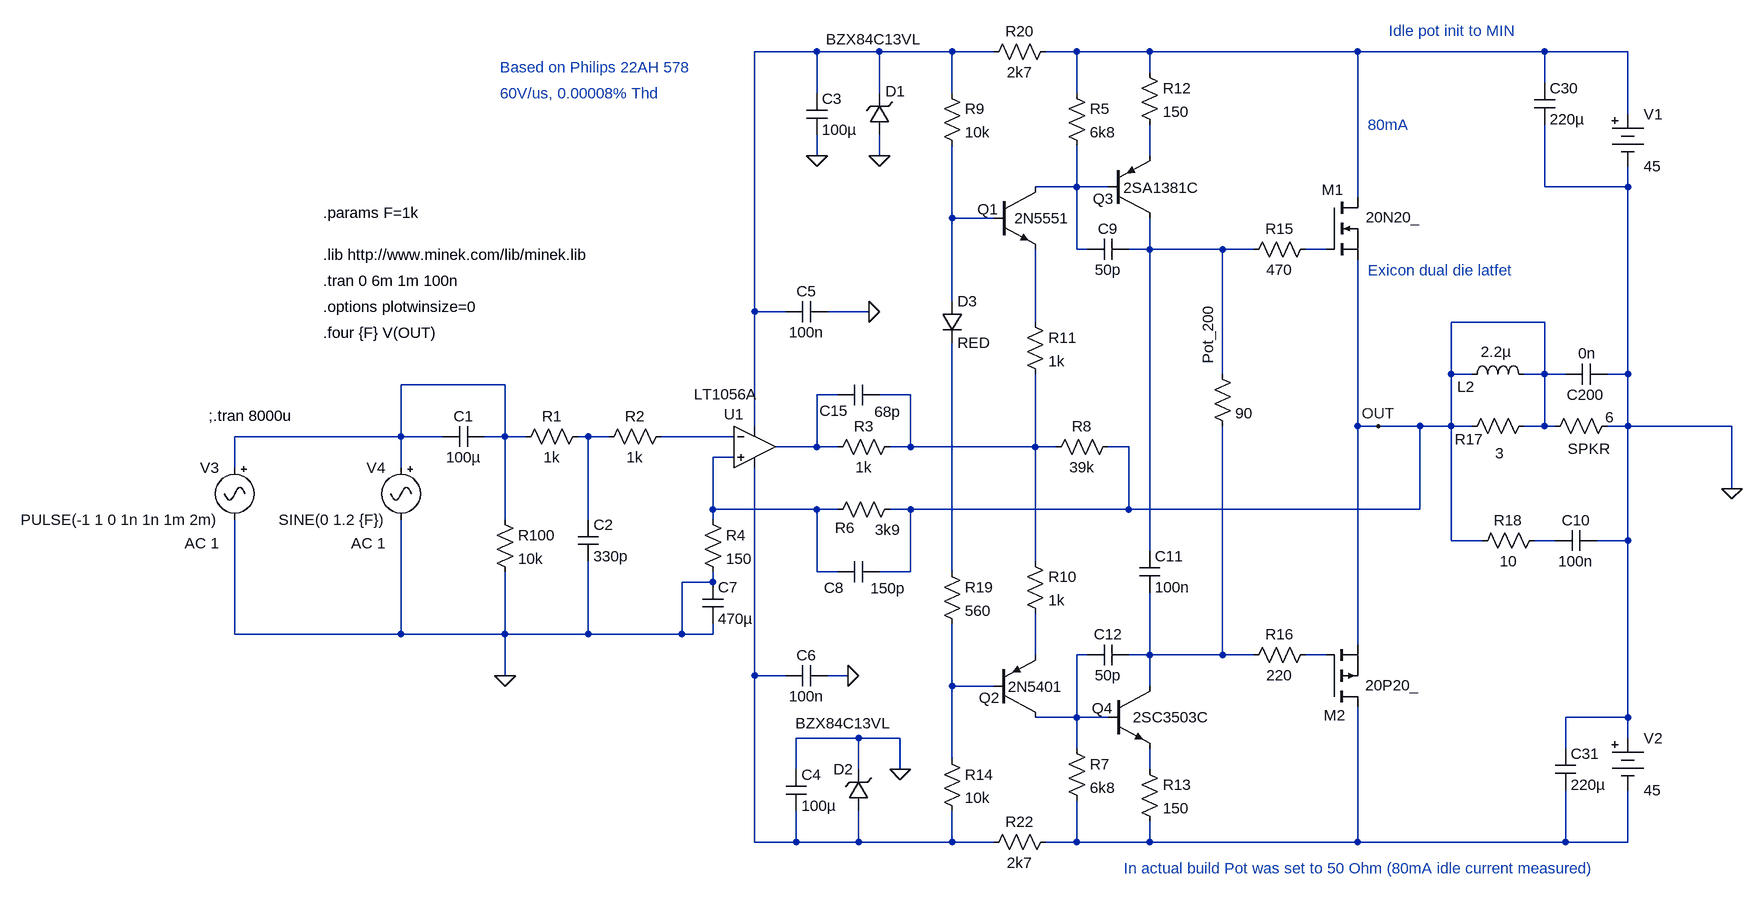
[diagram p0: schematic aa.asc]
aa.asc, the LTspice schematic file:
Version 4
SHEET 1 1932 832
WIRE -1568 -880 -1664 -880
WIRE -1472 -880 -1568 -880
WIRE -1360 -880 -1472 -880
WIRE -1296 -880 -1360 -880
WIRE -1168 -880 -1216 -880
WIRE -1056 -880 -1168 -880
WIRE -736 -880 -1056 -880
WIRE -448 -880 -736 -880
WIRE -320 -880 -448 -880
WIRE -1056 -848 -1056 -880
WIRE -448 -832 -448 -880
WIRE -1568 -816 -1568 -880
WIRE -1472 -816 -1472 -880
WIRE -1360 -816 -1360 -880
WIRE -1168 -816 -1168 -880
WIRE -320 -784 -320 -880
WIRE -1568 -720 -1568 -752
WIRE -1472 -720 -1472 -752
WIRE -1056 -720 -1056 -768
WIRE -1168 -672 -1168 -736
WIRE -1168 -672 -1232 -672
WIRE -1120 -672 -1168 -672
WIRE -448 -672 -448 -768
WIRE -320 -672 -320 -704
WIRE -320 -672 -448 -672
WIRE -736 -656 -736 -880
WIRE -1360 -624 -1360 -736
WIRE -1296 -624 -1360 -624
WIRE -1168 -576 -1168 -672
WIRE -1152 -576 -1168 -576
WIRE -1056 -576 -1056 -624
WIRE -1056 -576 -1088 -576
WIRE -944 -576 -1056 -576
WIRE -896 -576 -944 -576
WIRE -784 -576 -816 -576
WIRE -1360 -496 -1360 -624
WIRE -1664 -480 -1664 -880
WIRE -1616 -480 -1664 -480
WIRE -1488 -480 -1552 -480
WIRE -1232 -464 -1232 -576
WIRE -448 -464 -592 -464
WIRE -944 -384 -944 -576
WIRE -592 -384 -592 -464
WIRE -560 -384 -592 -384
WIRE -448 -384 -448 -464
WIRE -448 -384 -480 -384
WIRE -416 -384 -448 -384
WIRE -320 -384 -320 -672
WIRE -320 -384 -352 -384
WIRE -2048 -368 -2208 -368
WIRE -1536 -352 -1568 -352
WIRE -1424 -352 -1472 -352
WIRE -1664 -304 -1664 -480
WIRE -736 -304 -736 -560
WIRE -704 -304 -736 -304
WIRE -640 -304 -704 -304
WIRE -592 -304 -592 -384
WIRE -592 -304 -640 -304
WIRE -560 -304 -592 -304
WIRE -448 -304 -448 -384
WIRE -448 -304 -480 -304
WIRE -432 -304 -448 -304
WIRE -320 -304 -320 -384
WIRE -320 -304 -352 -304
WIRE -160 -304 -320 -304
WIRE -2208 -288 -2208 -368
WIRE -2208 -288 -2464 -288
WIRE -2144 -288 -2208 -288
WIRE -2048 -288 -2048 -368
WIRE -2048 -288 -2080 -288
WIRE -2016 -288 -2048 -288
WIRE -1920 -288 -1936 -288
WIRE -1888 -288 -1920 -288
WIRE -1696 -288 -1808 -288
WIRE -1568 -272 -1568 -352
WIRE -1568 -272 -1632 -272
WIRE -1536 -272 -1568 -272
WIRE -1424 -272 -1424 -352
WIRE -1424 -272 -1456 -272
WIRE -1232 -272 -1232 -384
WIRE -1232 -272 -1424 -272
WIRE -1200 -272 -1232 -272
WIRE -1088 -272 -1120 -272
WIRE -1696 -256 -1728 -256
WIRE -2464 -240 -2464 -288
WIRE -2208 -240 -2208 -288
WIRE -160 -208 -160 -304
WIRE -1728 -176 -1728 -256
WIRE -1568 -176 -1728 -176
WIRE -1536 -176 -1568 -176
WIRE -1424 -176 -1456 -176
WIRE -1088 -176 -1088 -272
WIRE -1088 -176 -1424 -176
WIRE -640 -176 -640 -304
WIRE -640 -176 -1088 -176
WIRE -2048 -160 -2048 -288
WIRE -1920 -160 -1920 -288
WIRE -1728 -160 -1728 -176
WIRE -592 -128 -592 -304
WIRE -544 -128 -592 -128
WIRE -432 -128 -464 -128
WIRE -320 -128 -320 -304
WIRE -320 -128 -368 -128
WIRE -1056 -112 -1056 -576
WIRE -1232 -96 -1232 -272
WIRE -1568 -80 -1568 -176
WIRE -1536 -80 -1568 -80
WIRE -1424 -80 -1424 -176
WIRE -1424 -80 -1472 -80
WIRE -1360 -80 -1360 -432
WIRE -1728 -64 -1728 -80
WIRE -1728 -64 -1776 -64
WIRE -2464 16 -2464 -160
WIRE -2208 16 -2208 -160
WIRE -2208 16 -2464 16
WIRE -2048 16 -2048 -80
WIRE -2048 16 -2208 16
WIRE -1920 16 -1920 -96
WIRE -1920 16 -2048 16
WIRE -1776 16 -1776 -64
WIRE -1776 16 -1920 16
WIRE -1728 16 -1728 0
WIRE -1728 16 -1776 16
WIRE -736 32 -736 -304
WIRE -1232 48 -1232 -16
WIRE -1152 48 -1168 48
WIRE -1056 48 -1056 -48
WIRE -1056 48 -1088 48
WIRE -944 48 -944 -304
WIRE -944 48 -1056 48
WIRE -896 48 -944 48
WIRE -784 48 -816 48
WIRE -2048 80 -2048 16
WIRE -1664 80 -1664 -240
WIRE -1616 80 -1664 80
WIRE -1520 80 -1552 80
WIRE -1360 96 -1360 0
WIRE -1296 96 -1360 96
WIRE -1056 96 -1056 48
WIRE -1168 144 -1168 48
WIRE -1168 144 -1232 144
WIRE -1120 144 -1168 144
WIRE -320 144 -320 -128
WIRE -320 144 -416 144
WIRE -1504 176 -1600 176
WIRE -1440 176 -1504 176
WIRE -320 176 -320 144
WIRE -1168 192 -1168 144
WIRE -416 192 -416 144
WIRE -1360 208 -1360 96
WIRE -1600 224 -1600 176
WIRE -1504 224 -1504 176
WIRE -1440 224 -1440 176
WIRE -1056 224 -1056 192
WIRE -1664 336 -1664 80
WIRE -1600 336 -1600 288
WIRE -1600 336 -1664 336
WIRE -1504 336 -1504 288
WIRE -1504 336 -1600 336
WIRE -1360 336 -1360 288
WIRE -1360 336 -1504 336
WIRE -1296 336 -1360 336
WIRE -1168 336 -1168 272
WIRE -1168 336 -1216 336
WIRE -1056 336 -1056 304
WIRE -1056 336 -1168 336
WIRE -736 336 -736 128
WIRE -736 336 -1056 336
WIRE -416 336 -416 256
WIRE -416 336 -736 336
WIRE -320 336 -320 256
WIRE -320 336 -416 336
FLAG -2048 80 0
FLAG -160 -208 0
FLAG -704 -304 OUT
FLAG -1472 -720 0
FLAG -1568 -720 0
FLAG -1440 224 0
FLAG -1488 -480 0
FLAG -1520 80 0
SYMBOL res -1792 -304 R90
WINDOW 0 0 56 VBottom 2
WINDOW 3 32 56 VTop 2
SYMATTR InstName R2
SYMATTR Value 1k
SYMBOL Misc\\signal -2208 -256 M0
WINDOW 123 24 132 Left 2
WINDOW 39 0 0 Left 2
SYMATTR Value2 AC 1
SYMATTR InstName V4
SYMATTR Value SINE(0 1.2 {F})
SYMBOL res -1440 -192 R90
WINDOW 0 60 85 VBottom 2
WINDOW 3 32 19 VTop 2
SYMATTR InstName R6
SYMATTR Value 3k9
SYMBOL Misc\\battery -320 -800 R0
WINDOW 123 0 0 Left 2
WINDOW 39 0 0 Left 2
SYMATTR InstName V1
SYMATTR Value 45
SYMBOL Misc\\battery -320 160 R0
WINDOW 123 0 0 Left 2
WINDOW 39 0 0 Left 2
SYMATTR InstName V2
SYMATTR Value 45
SYMBOL res -336 -320 R90
WINDOW 0 66 44 VBottom 2
WINDOW 3 -13 12 VTop 2
SYMATTR InstName SPKR
SYMATTR Value 6
SYMBOL cap -464 -832 R0
SYMATTR InstName C30
SYMATTR Value 220µ
SYMATTR SpiceLine V=100
SYMBOL cap -432 192 R0
SYMATTR InstName C31
SYMATTR Value 220µ
SYMATTR SpiceLine V=100
SYMBOL zener -1456 -752 R180
WINDOW 0 -24 67 Left 2
WINDOW 3 -49 147 Left 2
SYMATTR InstName D1
SYMATTR Value BZX84C13VL
SYMATTR Description Diode
SYMATTR Type diode
SYMBOL cap -1584 -816 R0
SYMATTR InstName C3
SYMATTR Value 100µ
SYMBOL zener -1488 288 R180
WINDOW 0 24 64 Left 2
WINDOW 3 -34 135 Left 2
SYMATTR InstName D2
SYMATTR Value BZX84C13VL
SYMATTR Description Diode
SYMATTR Type diode
SYMBOL cap -1616 224 R0
SYMATTR InstName C4
SYMATTR Value 100µ
SYMBOL cap -1536 -64 R270
WINDOW 0 -24 -6 VTop 2
WINDOW 3 6 77 VBottom 2
SYMATTR InstName C8
SYMATTR Value 150p
SYMBOL res -560 -112 R270
WINDOW 0 32 56 VTop 2
WINDOW 3 0 56 VBottom 2
SYMATTR InstName R18
SYMATTR Value 10
SYMATTR SpiceLine pwr=2
SYMBOL cap -432 -112 R270
WINDOW 0 32 32 VTop 2
WINDOW 3 0 32 VBottom 2
SYMATTR InstName C10
SYMATTR Value 100n
SYMBOL cap -2080 -304 R90
WINDOW 0 0 32 VBottom 2
WINDOW 3 32 32 VTop 2
SYMATTR InstName C1
SYMATTR Value 100µ
SYMBOL res -1440 -288 R90
WINDOW 0 0 56 VBottom 2
WINDOW 3 32 56 VTop 2
SYMATTR InstName R3
SYMATTR Value 1k
SYMBOL pnp -1120 -624 M180
WINDOW 0 -23 30 Left 2
WINDOW 3 140 47 Right 2
SYMATTR InstName Q3
SYMATTR Value 2SA1381C
SYMBOL res -1072 -864 R0
SYMATTR InstName R12
SYMATTR Value 150
SYMBOL npn -1120 96 R0
WINDOW 0 -25 34 Left 2
WINDOW 3 38 48 Left 2
SYMATTR InstName Q4
SYMATTR Value 2SC3503C
SYMBOL res -1072 208 R0
SYMATTR InstName R13
SYMATTR Value 150
SYMBOL cap -1072 -112 R0
SYMATTR InstName C11
SYMATTR Value 100n
SYMBOL Opamps\\LT1056A -1664 -336 R0
WINDOW 0 -47 14 Left 2
WINDOW 3 -93 -17 Left 2
SYMATTR InstName U1
SYMBOL nmos -784 -656 R0
WINDOW 0 -7 -12 Left 2
WINDOW 3 61 31 Left 2
SYMATTR InstName M1
SYMATTR Value 20N20_
SYMBOL pmos -784 128 M180
WINDOW 0 -4 -13 Left 2
WINDOW 3 60 33 Left 2
SYMATTR InstName M2
SYMATTR Value 20P20_
SYMBOL res -960 -400 R0
WINDOW 0 -6 -90 VRight 2
SYMATTR InstName Pot_200
SYMATTR Value 90
SYMBOL res -800 -592 R90
WINDOW 0 0 56 VBottom 2
WINDOW 3 32 56 VTop 2
SYMATTR InstName R15
SYMATTR Value 470
SYMBOL res -800 32 R90
WINDOW 0 0 56 VBottom 2
WINDOW 3 32 56 VTop 2
SYMATTR InstName R16
SYMATTR Value 220
SYMBOL res -464 -320 R90
WINDOW 0 52 100 VBottom 2
WINDOW 3 42 53 VTop 2
SYMATTR InstName R17
SYMATTR Value 3
SYMBOL ind -576 -368 R270
WINDOW 0 -19 7 VTop 2
WINDOW 3 66 53 VBottom 2
SYMATTR InstName L2
SYMATTR Value 2.2µ
SYMATTR SpiceLine Ipk=5 Rser=0.016 Rpar=0 Cpar=0 mfg="Murata" pn="LQH5BPN2R2N38L"
SYMBOL cap -352 -400 R90
WINDOW 0 63 33 VBottom 2
WINDOW 3 -32 31 VTop 2
SYMATTR InstName C200
SYMATTR Value 0n
SYMBOL cap -1616 -464 R270
WINDOW 0 32 32 VTop 2
WINDOW 3 0 32 VBottom 2
SYMATTR InstName C5
SYMATTR Value 100n
SYMBOL cap -1552 64 R90
WINDOW 0 0 32 VBottom 2
WINDOW 3 32 32 VTop 2
SYMATTR InstName C6
SYMATTR Value 100n
SYMBOL Misc\\signal -2464 -256 M0
WINDOW 123 24 132 Left 2
WINDOW 39 0 0 Left 2
SYMATTR Value2 AC 1
SYMATTR InstName V3
SYMATTR Value PULSE(-1 1 0 1n 1n 1m 2m)
SYMBOL res -1920 -304 R90
WINDOW 0 0 56 VBottom 2
WINDOW 3 32 56 VTop 2
SYMATTR InstName R1
SYMATTR Value 1k
SYMBOL cap -1936 -160 R0
SYMATTR InstName C2
SYMATTR Value 330p
SYMBOL res -2064 -176 R0
SYMATTR InstName R100
SYMATTR Value 10k
SYMBOL res -1744 -176 R0
SYMATTR InstName R4
SYMATTR Value 150
SYMBOL cap -1744 -64 R0
SYMATTR InstName C7
SYMATTR Value 470µ
SYMBOL res -1184 -832 R0
SYMATTR InstName R5
SYMATTR Value 6k8
SYMBOL res -1184 176 R0
SYMATTR InstName R7
SYMATTR Value 6k8
SYMBOL npn -1296 -672 R0
WINDOW 0 -25 34 Left 2
WINDOW 3 32 48 Left 2
SYMATTR InstName Q1
SYMATTR Value 2N5551
SYMBOL res -1104 -288 R90
WINDOW 0 0 56 VBottom 2
WINDOW 3 32 56 VTop 2
SYMATTR InstName R8
SYMATTR Value 39k
SYMBOL pnp -1296 144 M180
WINDOW 0 -23 30 Left 2
WINDOW 3 107 47 Right 2
SYMATTR InstName Q2
SYMATTR Value 2N5401
SYMBOL res -1248 -112 R0
SYMATTR InstName R10
SYMATTR Value 1k
SYMBOL res -1248 -480 R0
SYMATTR InstName R11
SYMATTR Value 1k
SYMBOL res -1376 -832 R0
SYMATTR InstName R9
SYMATTR Value 10k
SYMBOL res -1376 192 R0
SYMATTR InstName R14
SYMATTR Value 10k
SYMBOL diode -1376 -496 R0
SYMATTR InstName D3
SYMATTR Value RED
SYMBOL cap -1088 -592 R90
WINDOW 0 0 32 VBottom 2
WINDOW 3 32 32 VTop 2
SYMATTR InstName C9
SYMATTR Value 50p
SYMBOL cap -1088 32 R90
WINDOW 0 0 32 VBottom 2
WINDOW 3 32 32 VTop 2
SYMATTR InstName C12
SYMATTR Value 50p
SYMBOL res -1200 -896 R90
WINDOW 0 0 56 VBottom 2
WINDOW 3 32 56 VTop 2
SYMATTR InstName R20
SYMATTR Value 2k7
SYMATTR SpiceLine pwr=1
SYMBOL res -1200 320 R90
WINDOW 0 0 56 VBottom 2
WINDOW 3 32 56 VTop 2
SYMATTR InstName R22
SYMATTR Value 2k7
SYMATTR SpiceLine pwr=1
SYMBOL res -1376 -96 R0
SYMATTR InstName R19
SYMATTR Value 560
SYMBOL cap -1536 -336 R270
WINDOW 0 -24 -6 VTop 2
WINDOW 3 6 77 VBottom 2
SYMATTR InstName C15
SYMATTR Value 68p
TEXT -2328 -568 Left 2 !.lib http://www.minek.com/lib/minek.lib
TEXT -2328 -528 Left 2 !.tran 0 6m 1m 100n
TEXT -2328 -488 Left 2 !.options plotwinsize=0
TEXT -2328 -448 Left 2 !.four {F} V(OUT)
TEXT -720 -768 Left 2 ;80mA
TEXT -688 -912 Left 2 ;Idle pot init to MIN
TEXT -2504 -320 Left 2 !;.tran 8000u
TEXT -720 -544 Left 2 ;Exicon dual die latfet
TEXT -2056 -856 Left 2 ;Based on Philips 22AH 578
TEXT -2056 -816 Left 2 ;60V/us, 0.00008% Thd
TEXT -2328 -632 Left 2 !.params F=1k
TEXT -1096 376 Left 2 ;In actual build Pot was set to 50 Ohm (80mA idle current measured)

The netlist it stands for:
* aa.asc
R2 N013 N012 1k
V4 N009 0 SINE(0 1.2 {F}) AC 1
R6 OUT N014 3k9
V1 N002 0 45
V2 0 N024 45
R§SPKR 0 OUT 6
C30 N002 0 220µ V=100
C31 0 N024 220µ V=100
D1 0 N001 BZX84C13VL
C3 N001 0 100µ
D2 N021 0 BZX84C13VL
C4 0 N021 100µ
C8 N014 OUT 150p
R18 OUT N015 10 pwr=2
C10 N015 0 100n
C1 N009 N009 100µ
R3 N011 N010 1k
Q3 N006 N004 N003 0 2SA1381C
R12 N002 N003 150
Q4 N019 N018 N023 0 2SC3503C
R13 N023 N024 150
C11 N006 N019 100n
XU1 N014 N013 N001 N021 N010 LT1056A  ; pins In+ In- V+ V- OUT
M1 N002 N007 OUT OUT 20N20_
M2 N024 N020 OUT OUT 20P20_
R§Pot_200 N006 N019 90
R15 N007 N006 470
R16 N020 N019 220
R17 OUT OUT 3
L2 OUT OUT 2.2µ Ipk=5 Rser=0.016 Rpar=0 Cpar=0 mfg="Murata" pn="LQH5BPN2R2N38L"
C200 0 OUT 0n
C5 N001 0 100n
C6 0 N021 100n
V3 N009 0 PULSE(-1 1 0 1n 1n 1m 2m) AC 1
R1 N012 N009 1k
C2 N012 0 330p
R100 N009 0 10k
R4 N014 0 150
C7 0 0 470µ
R5 N002 N004 6k8
R7 N018 N024 6k8
Q1 N004 N005 N008 0 2N5551
R8 OUT N011 39k
Q2 N018 N022 N017 0 2N5401
R10 N011 N017 1k
R11 N008 N011 1k
R9 N001 N005 10k
R14 N022 N021 10k
D3 N005 N016 RED
C9 N006 N004 50p
C12 N019 N018 50p
R20 N002 N001 2k7 pwr=1
R22 N024 N021 2k7 pwr=1
R19 N016 N022 560
C15 N010 N011 68p
.model D D
.lib standard.dio
.model NPN NPN
.model PNP PNP
.lib standard.bjt
.model NMOS NMOS
.model PMOS PMOS
.lib standard.mos
.lib http://www.minek.com/lib/minek.lib
.tran 0 6m 1m 100n
.options plotwinsize=0
.four {F} V(OUT)
* 80mA
* Idle pot init to MIN
;.tran 8000u
* Exicon dual die latfet
* Based on Philips 22AH 578
* 60V/us, 0.00008% Thd
.params F=1k
* In actual build Pot was set to 50 Ohm (80mA idle current measured)
.backanno
.end